# EAGLE design USB charger circuit (EAGLE 7.5.0)
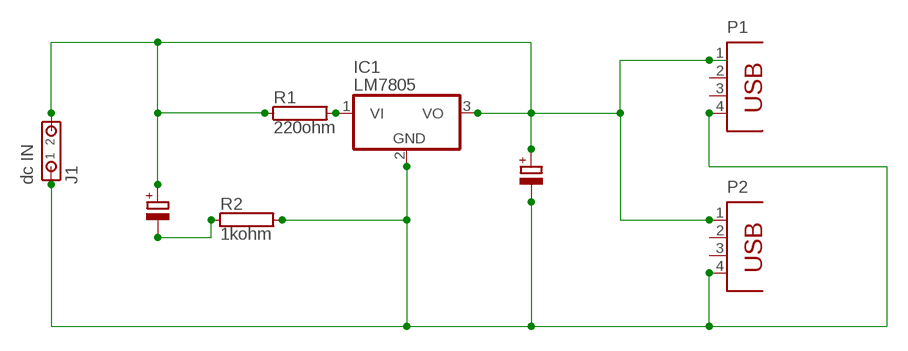
[diagram p0: schematic, sheet 1]

## Parts
IC1  LM7805  7812T  [TO220H]
J1  dc IN  794681-2  [794681-2]
P1  PN87520  [PN87520]
P2  PN87520  [PN87520]
R1  220ohm  RAC01  [AC01]
R2  1kohm  RAC01  [AC01]

## Nets
N$1: IC1.1(VI) R1.2
N$2: IC1.3(VO) J1.2 P1.1 P2.1 R1.1
N$3: IC1.2(GND) J1.1 P1.4 P2.4 R2.2
N$5: R2.1
Unconnected: P1.2 P1.3 P2.2 P2.3

## Library data of the parts
IC1 = linear:78*: Positive VOLTAGE REGULATOR Source: http://cache.national.com/ds/LM/LM78L05.pdf http://www.fairchildsemi.com/ds/LM/LM7805.pdf
J1 = con-amp:794681-2: Micro MATE-N-LOK Connectors grid 1.5mm Dual Row Through Hole Vertical Metal Through Hole Holddowns Source: ENG_CD_794681_E.pdf
P1 P2 = con-berg:PN87520: BERG USB connector; OC_FARNELL: unknown; OC_NEWARK: unknown
R1 R2 = resistor-power:R: Power Resitor; OC_FARNELL: unknown; OC_NEWARK: unknown

## Board
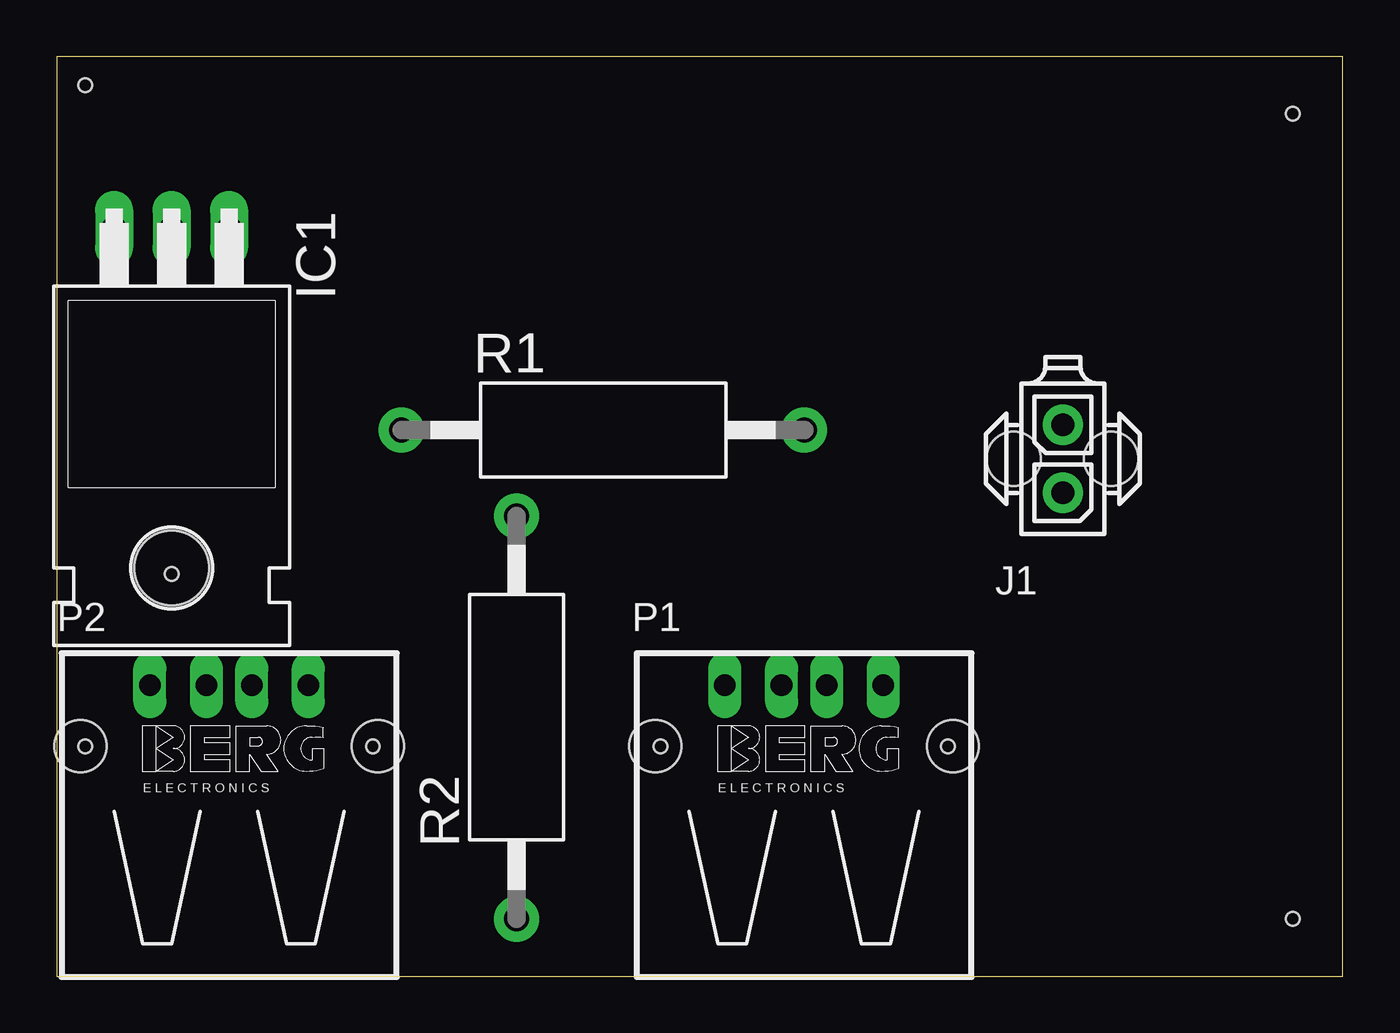
[diagram p1: board, top side]
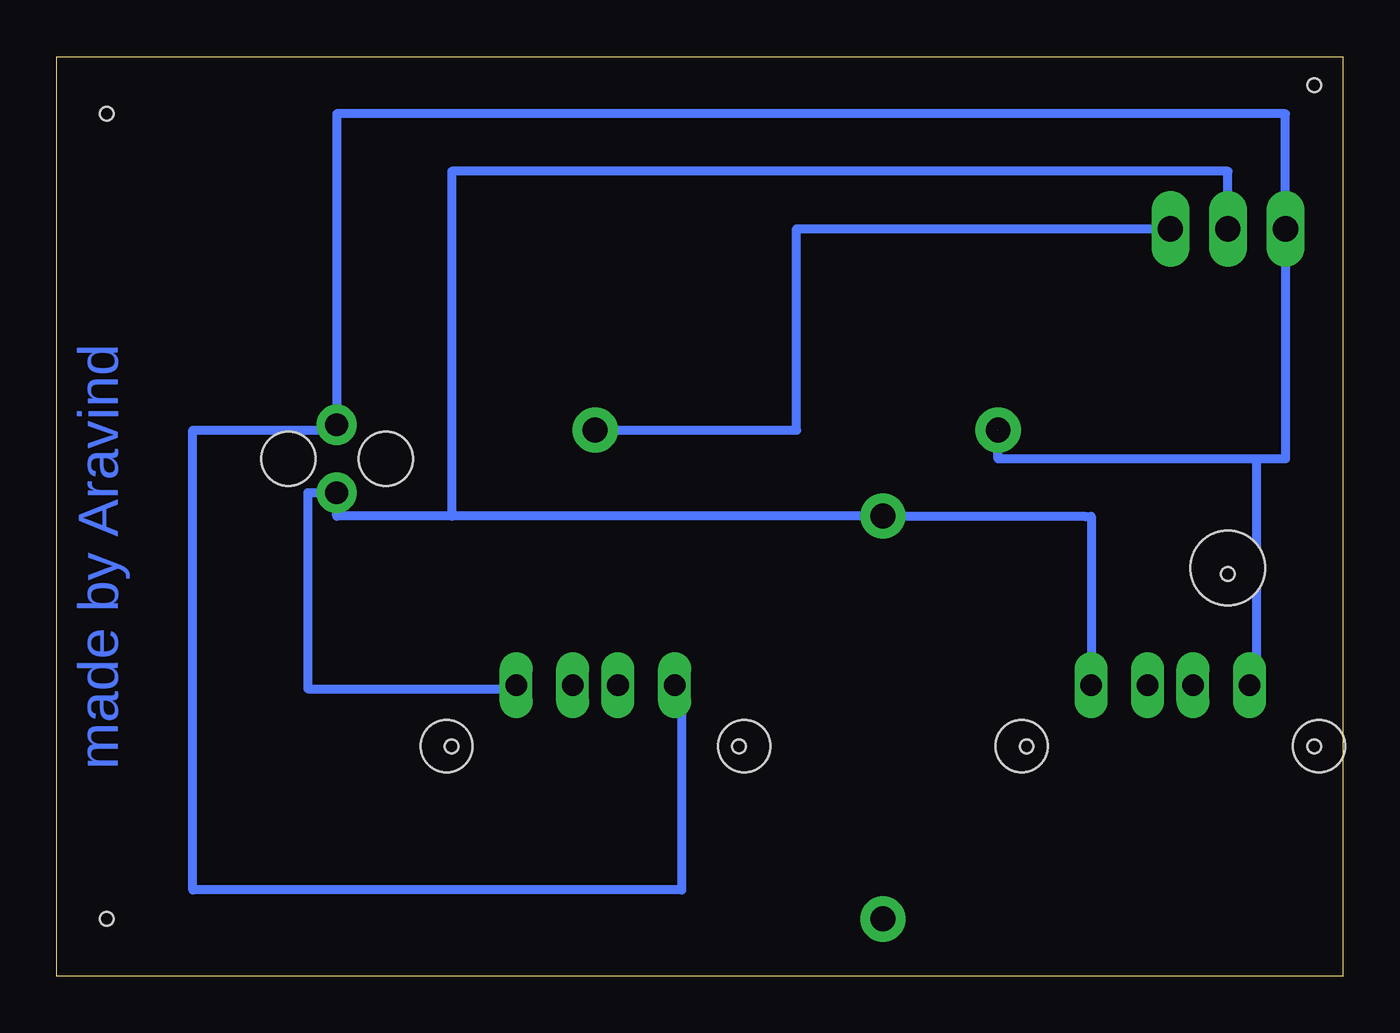
[diagram p2: board, bottom side, seen from below]

Size 56.82 x 40.63 mm. Coordinates in mm from the lower left corner, seen from the top.
Outline: 0,0 56.82,0 56.82,40.63 0,40.63 0,0
Copper layers (1*16): Top 0.035mm / dielectric 1.5mm / Bottom 0.035mm
Design rules "default": minimum track width 10mil, minimum drill 24mil, track to track 8mil, track to pad 8mil, pad to pad 8mil, via to via 8mil, smd to smd 8mil, copper to edge 40mil, drill to drill 8mil, minimum pad ring 10mil, minimum via ring 8mil, stop-mask expansion 4mil, vias tented up to drill 0mil, thermal gap 10mil
Holes 0.6 mm at 54.61,38.1 54.61,2.54 5.08,17.78 1.27,39.37 13.97,10.16 1.27,10.16 39.37,10.16 26.67,10.16

### Footprints (pad centres in the part's own frame; a part is rotated, then mirrored left to right if it is on the bottom)
TO220H = drill 1.118 long: 1 -2.54,-10.16; 2 0,-10.16; 3 2.54,-10.16 | hole 3.302: 0,4.826
794681-2 = drill 1 pad 1.778: 1 0,-1.5; 2 0,1.5 | hole 2.4: 2.13,0; -2.17,0
PN87520 = drill 0.95 long: 1 -3.5,2.71; 2 -1,2.71; 3 1,2.71; 4 3.5,2.71 | hole 2.3: -6.57,0; 6.57,0
AC01 = drill 1.1 pad 2: 1 -8.9,0; 2 8.9,0

### Placement (x,y rotation side)
IC1  5.08,22.86 180 top
J1  44.45,22.86 0 top
P1  33.02,10.16 0 top
P2  7.62,10.16 0 top
R1  24.13,24.13 0 top
R2  20.32,11.43 90 top

### Tracks (layer width: path | path; a pad name or v marks a point on that pad's centre or on a via)
N$1
  Bottom 0.406: R1.2 24.13,24.13 24.13,33.02 IC1.1
N$2  (1 unrouted)
  Bottom 0.406: P1.1 29.21,12.87 29.21,3.81 50.8,3.81 50.8,24.13 44.45,24.13 J1.2 44.45,38.1 2.54,38.1 IC1.3 2.54,22.86 3.81,22.86 | 3.81,22.86 15.24,22.86 R1.1 | P2.1 3.81,12.87 3.81,22.86
N$3
  Bottom 0.406: P1.4 36.52,12.7 45.72,12.7 45.72,21.36 J1.1 44.45,20.33 | 39.37,20.33 R2.2 11.43,20.33 11.43,20.32 11.12,20.32 P2.4 | 39.37,20.33 44.45,20.33 | 44.45,20.33 44.45,20.32 | IC1.2 5.08,35.56 39.37,35.56 39.37,20.33

### Text on the board
Bottom: made by Aravind